# EAGLE design piezoamp (EAGLE 5.06)
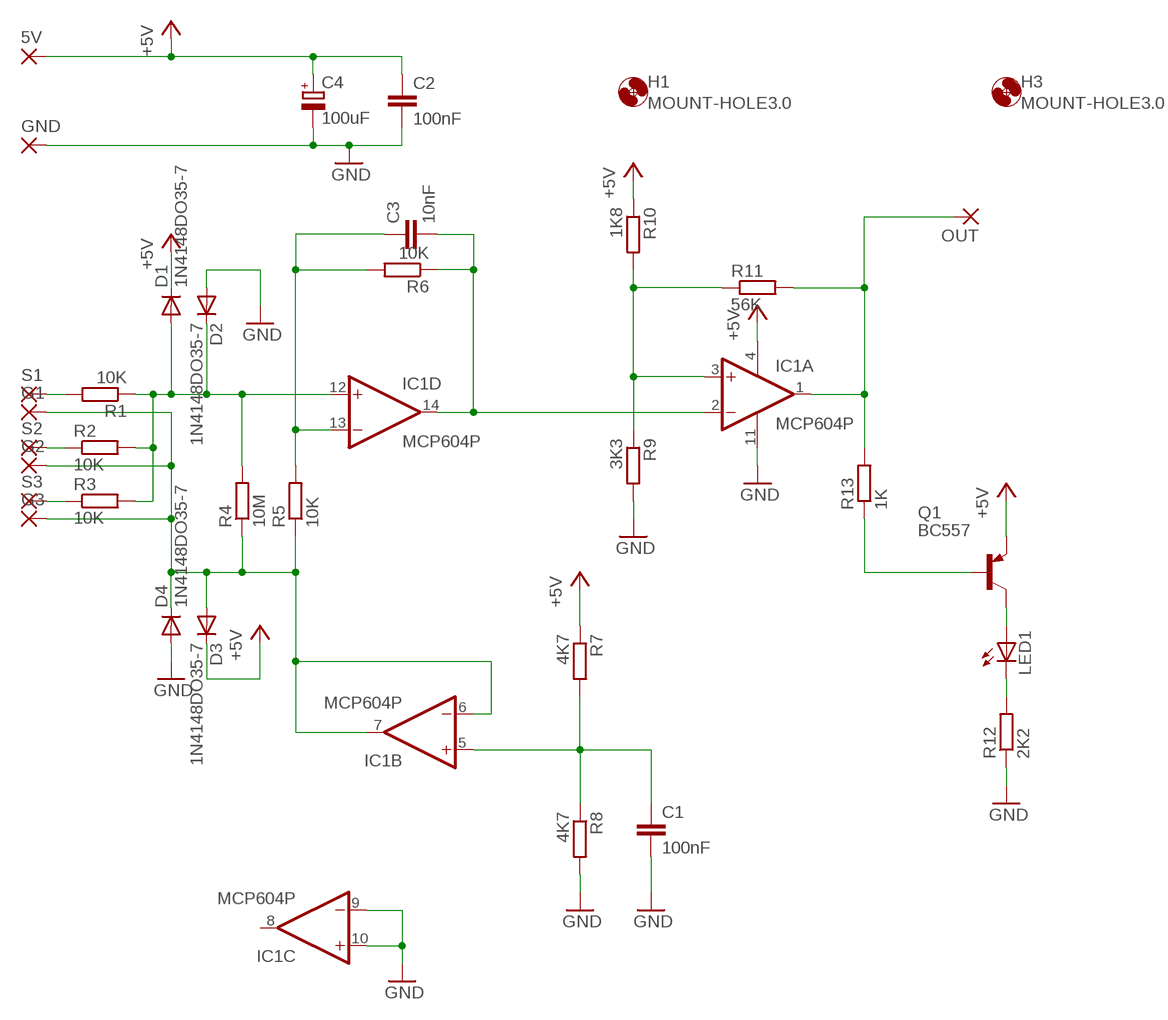
[diagram p0: schematic, sheet 1]

## Parts
5V  3,81/1,3  [3,81/1,3]
C1  100nF  C-EU050-025X075  [C050-025X075]
C2  100nF  C-EU050-025X075  [C050-025X075]
C3  10nF  C-EU050-025X075  [C050-025X075]
C4  100uF  CPOL-EUE5-10.5  [E5-10,5]
D1  1N4148DO35-7  [DO35-7]
D2  1N4148DO35-7  [DO35-7]
D3  1N4148DO35-7  [DO35-7]
D4  1N4148DO35-7  [DO35-7]
G1  3,81/1,3  [3,81/1,3]
G2  3,81/1,3  [3,81/1,3]
G3  3,81/1,3  [3,81/1,3]
GND  3,81/1,3  [3,81/1,3]
H1  MOUNT-HOLE3.0  [3,0]
H3  MOUNT-HOLE3.0  [3,0]
IC1  MCP604P  [DIL14]
LED1  LED5MM  [LED5MM]
OUT  3,81/1,3  [3,81/1,3]
Q1  BC557  [TO92-EBC]
R1  10K  R-EU_0207/10  [0207/10]
R2  10K  R-EU_0207/10  [0207/10]
R3  10K  R-EU_0207/10  [0207/10]
R4  10M  R-EU_0207/10  [0207/10]
R5  10K  R-EU_0207/10  [0207/10]
R6  10K  R-EU_0207/10  [0207/10]
R7  4K7  R-EU_0207/10  [0207/10]
R8  4K7  R-EU_0207/10  [0207/10]
R9  3K3  R-EU_0207/10  [0207/10]
R10  1K8  R-EU_0207/10  [0207/10]
R11  56K  R-EU_0207/10  [0207/10]
R12  2K2  R-EU_0207/10  [0207/10]
R13  1K  R-EU_0207/10  [0207/10]
S1  3,81/1,3  [3,81/1,3]
S2  3,81/1,3  [3,81/1,3]
S3  3,81/1,3  [3,81/1,3]

## Nets
+5V: 5V.1(P) C2.1 C4.+ D1.C D3.C IC1.4(P:V+) Q1.E R7.1 R10.1
GND: C1.2 C2.2 C4.- D2.A D4.A GND.1(P) IC1.9(C:-IN) IC1.10(C:+IN) IC1.11(P:V-) R8.2 R9.2 R12.1
N$1: D1.A D2.C IC1.12(D:+IN) R1.1 R2.2 R3.2 R4.2
N$2: C3.1 IC1.13(D:-IN) R5.2 R6.2
N$3: C3.2 IC1.2(A:-IN) IC1.14(D:OUT) R6.1
N$4: D3.A D4.C G1.1(P) G2.1(P) G3.1(P) IC1.6(B:-IN) IC1.7(B:OUT) R4.1 R5.1
N$5: C1.1 IC1.5(B:+IN) R7.2 R8.1
N$6: IC1.3(A:+IN) R9.1 R10.2 R11.1
N$7: LED1.A Q1.C
N$8: LED1.K(C) R12.2
N$9: Q1.B R13.1
N$10: IC1.1(A:OUT) OUT.1(P) R11.2 R13.2
N$11: R1.2 S1.1(P)
N$12: R2.1 S2.1(P)
N$13: R3.1 S3.1(P)
Unconnected: IC1.8(C:OUT)

## Library data of the parts
5V G1-G3 GND OUT S1-S3 = wirepad:3,81/1,3: THROUGH-HOLE PAD
C1-C3 = rcl:C-EU: CAPACITOR, European symbol
C4 = rcl:CPOL-EU: POLARIZED CAPACITOR, European symbol
D1-D4 = diode:1N4148: DIODE high speed (Philips)
H1 H3 = holes:MOUNT-HOLE: MOUNTING HOLE with drill center marker
IC1 = linear:MCP604: Quad Op Amp 2.7V to 6.0V Single Supply CMOS Source: http://ww1.microchip.com/downloads/en/DeviceDoc/21314g.pdf
LED1 = led:LED: LED OSRAM: - CHIPLED LG R971, LG N971, LY N971, LG Q971, LY Q971, LO R971, LY R971 LH N974, LH R974 LS Q976, LO Q976, LY Q976 LO Q996 - Hyper CHIPLED LW Q18S LB Q993, LB Q99A, LB R99A - SideLED LS A670, LO A670, LY A670, LG A670, LP A670 LB A673, LV A673, LT A673, LW A673 LH A674 LY A675 LS A676, LA A676, LO A676, LY A676, LW A676 LS A679, LY A679, LG A679 - Hyper Micro SIDELED® LS Y876, LA Y876, LO Y876, LY Y876 LT Y87S - SmartLED LW L88C, LW L88S LB L89C, LB L89S, LG L890 LS L89K, LO L89K, LY L89K LS L896, LA L896, LO L896, LY L896 - TOPLED LS T670, LO T670, LY T670, LG T670, LP T670 LSG T670, LSP T670, LSY T670, LOP T670, LYG T670 LG T671, LOG T671, LSG T671 LB T673, LV T673, LT T673, LW T673 LH T674 LS T676, LA T676, LO T676, LY T676, LB T676, LH T676, LSB T676, LW T676 LB T67C, LV T67C, LT T67C, LS T67K, LO T67K, LY T67K, LW E67C LS E67B, LA E67B, LO E67B, LY E67B, LB E67C, LV E67C, LT E67C LW T67C LS T679, LY T679, LG T679 LS T770, LO T770, LY T770, LG T770, LP T770 LB T773, LV T773, LT T773, LW T773 LH T774 LS E675, LA E675, LY E675, LS T675 LS T776, LA T776, LO T776, LY T776, LB T776 LHGB T686 LT T68C, LB T68C - Hyper Mini TOPLED® LB M676 - Mini TOPLED Santana® LG M470 LS M47K, LO M47K, LY M47K Source: http://www.osram.convergy.de LUXEON: - LUMILED® LXK2-PW12-R00, LXK2-PW12-S00, LXK2-PW14-U00, LXK2-PW14-V00 LXK2-PM12-R00, LXK2-PM12-S00, LXK2-PM14-U00 LXK2-PE12-Q00, LXK2-PE12-R00, LXK2-PE12-S00, LXK2-PE14-T00, LXK2-PE14-U00 LXK2-PB12-K00, LXK2-PB12-L00, LXK2-PB12-M00, LXK2-PB14-N00, LXK2-PB14-P00, LXK2-PB14-Q00 LXK2-PR12-L00, LXK2-PR12-M00, LXK2-PR14-Q00, LXK2-PR14-R00 LXK2-PD12-Q00, LXK2-PD12-R00, LXK2-PD12-S00 LXK2-PH12-R00, LXK2-PH12-S00 LXK2-PL12-P00, LXK2-PL12-Q00, LXK2-PL12-R00 Source: www.luxeon.com KINGBRIGHT: KA-3528ASYC Source: www.kingbright.com
Q1 = transistor-pnp:BC557*: PNP Transistror
R1-R13 = rcl:R-EU_: RESISTOR, European symbol

## Board
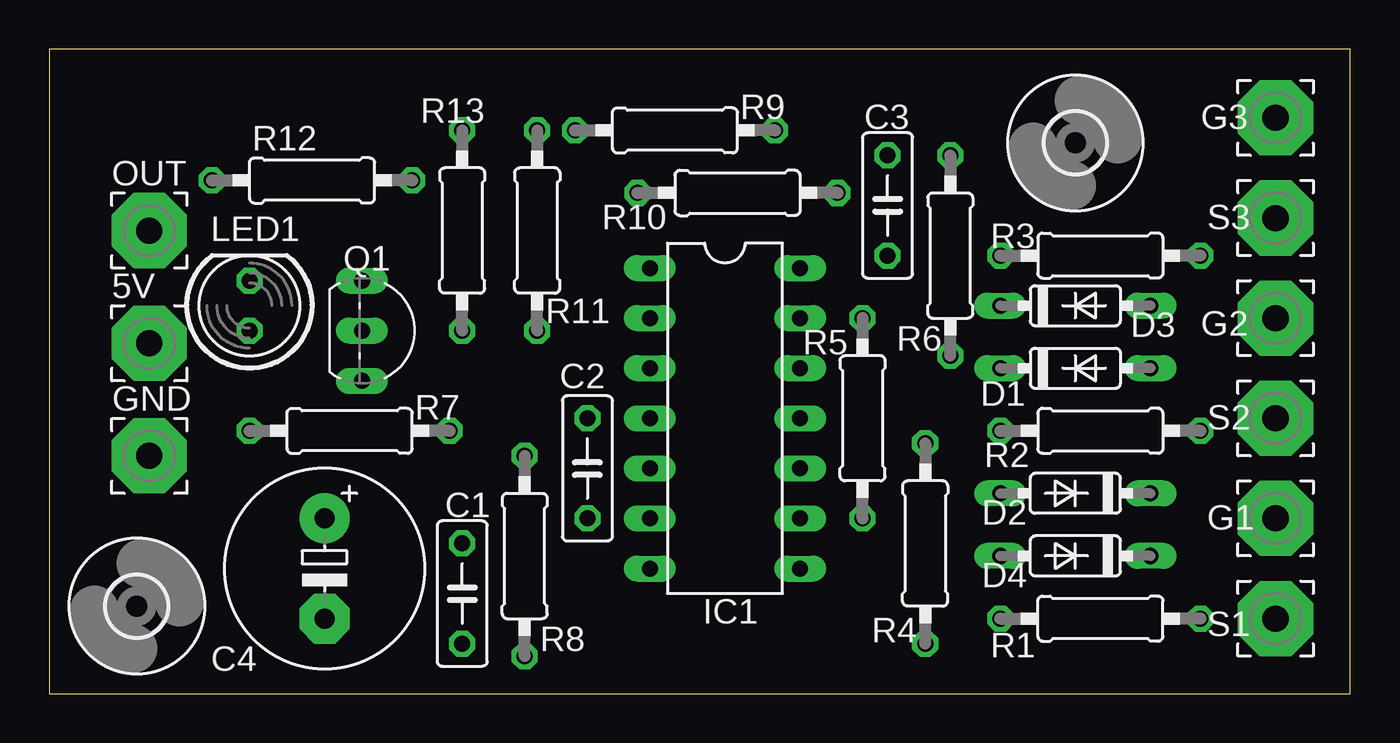
[diagram p1: board, top side]
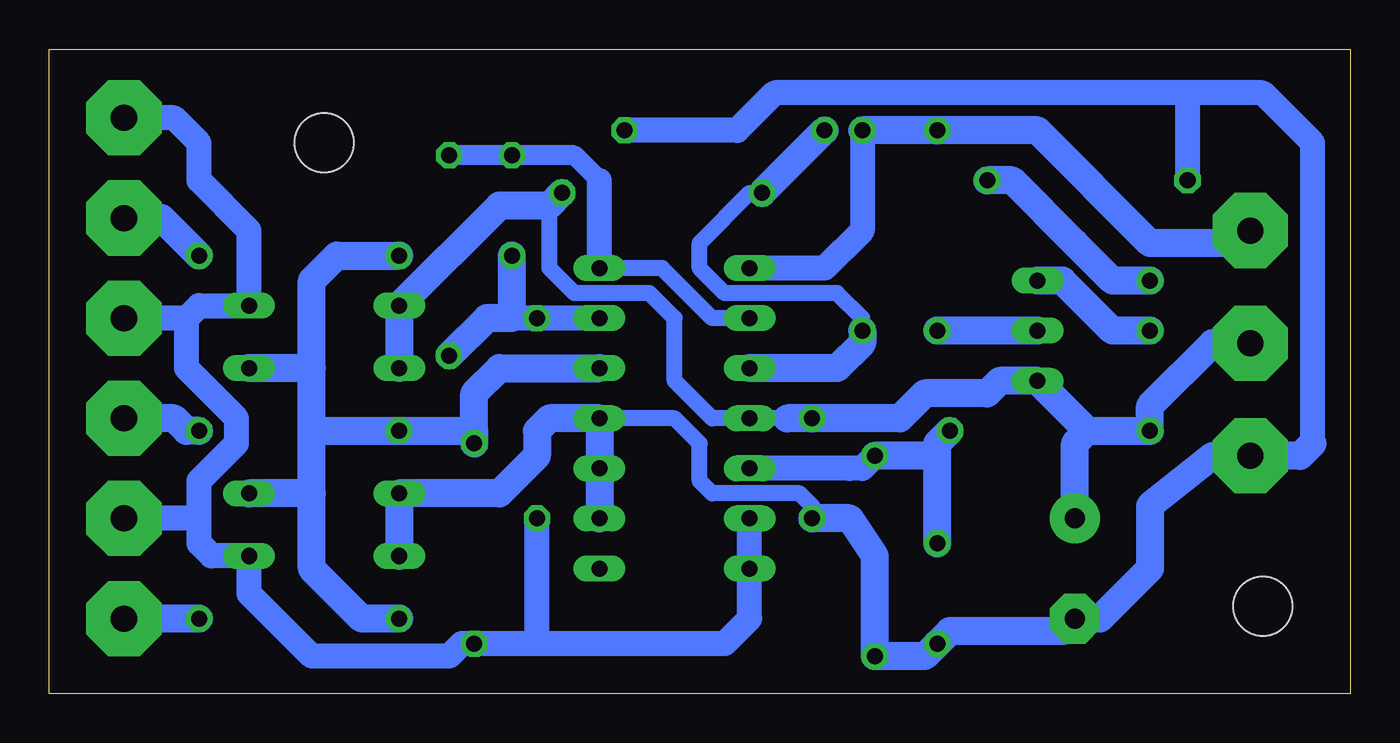
[diagram p2: board, bottom side, seen from below]

Size 66.02 x 32.69 mm. Coordinates in mm from the lower left corner, seen from the top.
Outline: 0,0 66.02,0 66.02,32.69 0,32.69 0,0
Copper layers (1*16): Top 0.035mm / dielectric 1.5mm / Bottom 0.035mm
Design rules "default": minimum track width 10mil, minimum drill 0.6mm, track to track 8mil, track to pad 8mil, pad to pad 8mil, via to via 8mil, smd to smd 8mil, copper to edge 40mil, drill to drill 8mil, minimum pad ring 10mil, minimum via ring 8mil, stop-mask expansion 4mil, vias tented up to drill 0mil, thermal gap 10mil

### Footprints (pad centres in the part's own frame; a part is rotated, then mirrored left to right if it is on the bottom)
3,81/1,3 = drill 1.321 pad 3.81 octagon: 1 0,0
C050-025X075 = drill 0.813 octagon: 1 -2.54,0; 2 2.54,0
E5-10,5 = drill 1.016 pad 2.54 round: + -2.54,0 | drill 1.016 pad 2.54 octagon: - 2.54,0
DO35-7 = drill 0.813 long: A 3.81,0; C -3.81,0
3,0 = hole 3: 0,0
DIL14 = drill 0.813 long: 1 -7.62,-3.81; 2 -5.08,-3.81; 3 -2.54,-3.81; 4 0,-3.81; 5 2.54,-3.81; 6 5.08,-3.81; 7 7.62,-3.81; 8 7.62,3.81; 9 5.08,3.81; 10 2.54,3.81; 11 0,3.81; 12 -2.54,3.81; 13 -5.08,3.81; 14 -7.62,3.81
LED5MM = drill 0.813 octagon: A -1.27,0; K 1.27,0
TO92-EBC = drill 0.813 long: B 0,-1.27; C -2.54,-1.27; E 2.54,-1.27
0207/10 = drill 0.813 octagon: 1 -5.08,0; 2 5.08,0

### Placement (x,y rotation side)
5V  5.08,17.78 0 top
C1  20.95,5.08 270 top
C2  27.3,11.43 270 top
C3  42.55,24.77 90 top
C4  13.97,6.35 270 top
D1  52.07,16.51 0 top
D2  52.07,10.16 180 top
D3  52.07,19.68 0 top
D4  52.07,6.99 180 top
G1  62.23,8.89 0 top
G2  62.23,19.05 0 top
G3  62.23,29.21 0 top
GND  5.08,12.06 0 top
H1  52.07,27.94 0 top
H3  4.45,4.45 0 top
IC1  34.29,13.97 270 top
LED1  10.16,19.68 90 top
OUT  5.08,23.5 0 top
Q1  17.14,18.41 270 top
R1  53.34,3.81 0 top
R2  53.34,13.34 180 top
R3  53.34,22.23 180 top
R4  44.45,7.62 90 top
R5  41.27,13.97 90 top
R6  45.72,22.23 270 top
R7  15.24,13.34 0 top
R8  24.13,6.99 270 top
R9  31.75,28.57 0 top
R10  34.92,25.4 180 top
R11  24.77,23.5 90 top
R12  13.34,26.04 0 top
R13  20.95,23.5 90 top
S1  62.23,3.81 0 top
S2  62.23,13.97 0 top
S3  62.23,24.13 0 top

### Tracks (layer width: path | path; a pad name or v marks a point on that pad's centre or on a via)
+5V
  Bottom 0.813: 40.64,24.77 40.64,21.59 39.37,20.32 35.56,20.32 34.29,19.05 34.29,15.88 32.38,13.97 28.57,13.97 IC1.4
  Bottom 1.422: D1.C D3.C 43.18,24.77 40.64,24.77 R10.1 | 5V.1 6.99,17.78 10.16,14.61 R7.1 13.34,13.34 | 13.34,13.34 13.97,12.7 C4.+ | 13.34,13.34 Q1.E 17.78,15.88 18.41,15.24 21.59,15.24 22.86,13.97 C2.1 28.57,13.97
GND
  Bottom 0.813: C2.2 27.3,9.53 27.94,10.16 32.38,10.16 33.02,10.79 33.02,12.7 34.29,13.97 IC1.11
  Bottom 1.27: 1.91,12.7 1.91,27.94 4.45,30.48 8.26,30.48 | R9.2 31.11,28.57 29.21,30.48 8.26,30.48 | 8.26,30.48 R12.1
  Bottom 1.422: D4.A D2.A 43.18,10.16 41.27,12.06 41.27,13.34 40.64,13.97 IC1.11 IC1.10 IC1.9 | 1.91,12.7 2.54,12.06 GND.1 6.99,12.06 10.16,9.53 10.16,6.35 12.7,3.81 C4.- 14.61,3.17 20.32,3.17 C1.2 21.59,1.91 R8.2 24.13,6.99 25.4,8.89 C2.2
N$1
  Bottom 1.422: 52.7,13.34 52.7,16.51 | 52.7,10.16 52.7,13.34 | 52.7,10.16 D2.C | 52.7,10.16 52.7,6.35 50.16,3.81 R1.1 | 44.45,13.34 R2.2 52.7,13.34 | 44.45,13.34 44.45,15.24 43.18,16.51 IC1.12 | 44.45,13.34 R4.2 | R3.2 51.44,22.23 52.7,20.95 52.7,16.51 | 52.7,16.51 D1.A
N$2
  Bottom 1.27: IC1.13 R5.2 42.55,19.05
  Bottom 1.422: R6.2 43.81,19.05 42.55,19.05 C3.1
N$3
  Bottom 0.813: IC1.2 32.38,19.05 34.92,21.59 IC1.14
  Bottom 1.016: R6.1 C3.2 39.37,27.3 38.1,26.04
  Bottom 1.27: IC1.14 38.1,26.04
N$4
  Bottom 1.27: G3.1 59.69,29.21 58.42,27.94 58.42,26.04 55.88,23.5 D3.A 58.42,19.68 59.05,19.05 | 59.05,19.05 G2.1 | 59.05,19.05 59.05,16.51 56.52,13.97 56.52,12.7 58.42,10.79 58.42,8.89 | 58.42,8.89 58.42,7.62 57.78,6.99 D4.C 55.88,5.08 52.7,1.91 45.72,1.91 45.09,2.54 R4.1 41.27,2.54 | 58.42,8.89 G1.1 | 41.27,2.54 R5.1 | 41.27,2.54 31.75,2.54 30.48,3.81 IC1.7 IC1.6
N$5
  Bottom 1.27: R8.1 24.77,11.43 25.4,11.43 IC1.5
  Bottom 1.422: R7.2 20.95,12.7 20.95,12.06 | C1.1 20.95,12.06 | 20.95,12.06 R8.1
N$6
  Bottom 0.813: R10.2 30.48,25.4 33.02,22.86 33.02,21.59 31.75,20.32 26.04,20.32 24.77,19.05 R11.1
  Bottom 1.422: R10.2 R9.1 | R11.1 24.77,17.78 26.04,16.51 IC1.3
N$7
  Bottom 1.422: Q1.C 14.61,20.95 12.06,18.41 LED1.A
N$8
  Bottom 1.422: LED1.K 12.06,20.95 13.97,22.86 17.14,26.04 R12.2
N$9
  Bottom 1.422: Q1.B R13.1
N$10
  Bottom 1.27: R11.2 24.77,23.5 26.67,21.59 IC1.1
  Bottom 1.422: OUT.1 5.08,22.86 10.16,22.86 15.88,28.57 R13.2 R11.2
N$11
  Bottom 1.422: R1.2 S1.1
N$12
  Bottom 1.422: R2.1 59.05,13.34 59.69,13.97 S2.1
N$13
  Bottom 1.422: R3.1 60.33,24.13 S3.1